# EAGLE design tx (EAGLE 6.5.0)
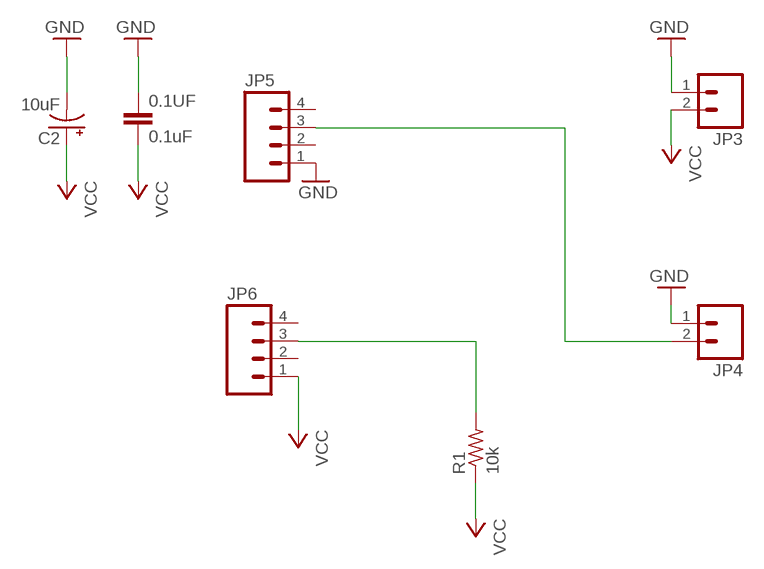
[diagram p0: schematic, sheet 1]

## Parts
0.1UF  0.1uF  0.1UF-100V-10%(0603)  [0603-CAP]
C2  10uF  CAP_POL6032  [EIA6032]
JP3  M02PTH  [1X02]
JP4  M02PTH  [1X02]
JP5  M041X04_NO_SILK  [1X04_NO_SILK]
JP6  M041X04_NO_SILK  [1X04_NO_SILK]
R1  10k  R-US_R0805  [R0805]

## Nets
GND: 0.1UF.1 C2.P$2(-) JP3.1 JP4.1 JP5.1
N$1: JP4.2 JP5.3
N$5: JP6.3 R1.2
VCC: 0.1UF.2 C2.P$1(+) JP3.2 JP6.1 R1.1
Unconnected: JP5.2 JP5.4 JP6.2 JP6.4

## Library data of the parts
0.1UF = SparkFun-Capacitors:0.1UF-100V-10%(0603): CAP-08390; PROD_ID: CAP-08390
C2 = SparkFun-Capacitors:CAP_POL: Capacitor Polarized These are standard SMD and PTH capacitors. Normally 10uF, 47uF, and 100uF in electrolytic and tantalum varieties. Always verify the external diameter of the through hole cap, it varies with capacity, voltage, and manufacturer. The EIA devices should be standard.
JP3 JP4 = SparkFun-Connectors:M02: Standard 2-pin 0.1" header. Use with - straight break away headers ( PRT-00116) - right angle break away headers (PRT-00553) - swiss pins (PRT-00743) - machine pins (PRT-00117) - female headers (PRT-00115) Molex polarized connector foot print use with: PRT-08233 with associated crimp pins and housings. 2.54_SCREWTERM for use with PRT-10571. 3.5mm Screw Terminal footprints for PRT-08084 5mm Screw Terminal footprints for use with PRT-08432
JP5 JP6 = SparkFun-Connectors:M04: Header 4 Standard 4-pin 0.1" header. Use with straight break away headers (SKU : PRT-00116), right angle break away headers (PRT-00553), swiss pins (PRT-00743), machine pins (PRT-00117), and female headers (PRT-00115). Molex polarized connector foot print use with SKU : PRT-08231 with associated crimp pins and housings. 1MM SMD Version SKU: PRT-10208
R1 = adafruit:R-US_: RESISTOR, American symbol

## Board
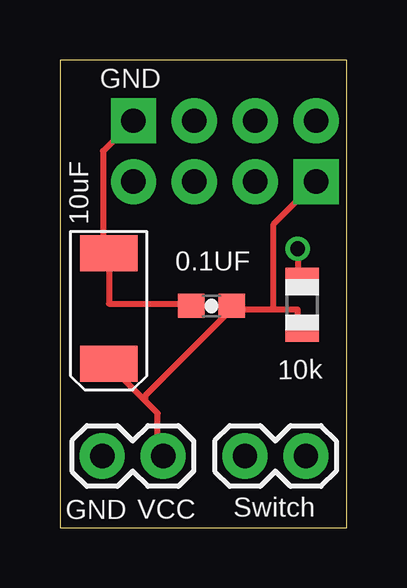
[diagram p1: board, top side]
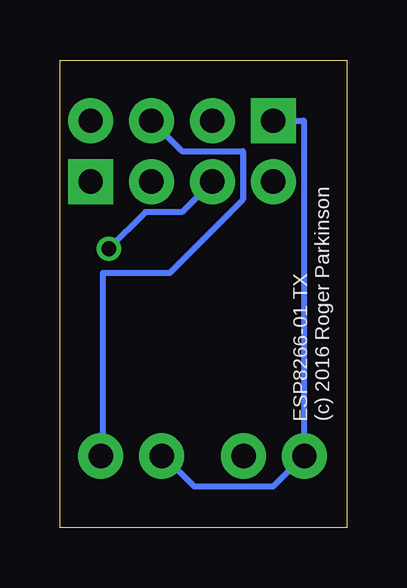
[diagram p2: board, bottom side, seen from below]

Size 11.97 x 19.48 mm. Coordinates in mm from the lower left corner, seen from the top.
Outline: 0,0 11.96,0 11.96,19.48 0,19.48 0,0
Copper layers (1*16): Top 0.035mm / dielectric 1.5mm / Bottom 0.035mm
Design rules "default": minimum track width 10mil, minimum drill 24mil, track to track 8mil, track to pad 8mil, pad to pad 8mil, via to via 8mil, smd to smd 8mil, copper to edge 40mil, drill to drill 8mil, minimum pad ring 10mil, minimum via ring 8mil, stop-mask expansion 4mil, vias tented up to drill 0mil, thermal gap 10mil

### Footprints (pad centres in the part's own frame; a part is rotated, then mirrored left to right if it is on the bottom)
0603-CAP = smd 1.1 x 1: 1 -0.85,0; 2 0.85,0
EIA6032 = smd 1.5 x 2.4: P$1 -2.3,0; P$2 2.3,0
1X02 = drill 1.016 pad 1.88: 1 0,0; 2 2.54,0
1X04_NO_SILK = drill 1.016 pad 1.88 square: 1 0,0 | drill 1.016 pad 1.88: 2 2.54,0; 3 5.08,0; 4 7.62,0
R0805 = smd 1.1 x 1.4: 1 -1,0; 2 1,0

### Placement (x,y rotation side)
0.1UF  6.32,9.23 0 top
C2  2.03,9.13 90 top
JP3  1.77,2.98 0 top
JP4  7.72,2.98 0 top
JP5  3.07,16.95 0 top
JP6  10.69,14.41 180 top
R1  10.11,9.28 90 top

### Tracks (layer width: path | path; a pad name or v marks a point on that pad's centre or on a via)
GND
  Top 0.254: 0.1UF.1 5.35,9.33 2.05,9.33 2.05,11.36 C2.P$2 1.8,11.62 1.8,15.68 JP5.1
  Bottom 0.254: 1.8,2.98 3.07,1.71 6.37,1.71 7.64,2.98 JP4.1 | 1.8,2.98 1.8,16.95 JP5.1 | 1.8,2.98 JP3.1
N$1
  Bottom 0.254: JP5.3 6.88,15.68 4.34,15.68 4.34,13.65 7.38,10.6 10.18,10.6 10.18,2.98 JP4.2
N$5  (via drill 0.61)
  Top 0.254: v9.92,11.62 9.92,10.35 R1.2
  Bottom 0.254: v9.92,11.62 8.4,13.14 6.88,13.14 JP6.3
VCC
  Top 0.254: 8.91,9.08 9.92,9.08 9.92,8.32 R1.1 | 8.91,9.08 7.38,9.08 0.1UF.2 7.13,9.08 3.57,5.52 3.57,5.27 | 3.57,5.27 4.08,4.76 4.08,2.98 JP3.2 | 3.57,5.27 2.05,6.79 C2.P$1 | JP6.1 8.91,12.63 8.91,9.08

### Text on the board
tPlace: GND | 10uF | GND | VCC | Switch
_bsilk: ESP8266-01 TX / (c) 2016 Roger Parkinson